# Altium schematic sheet Analog_Channel.SchDoc
size A4; SheetNumber: 2; SheetTotal: 6
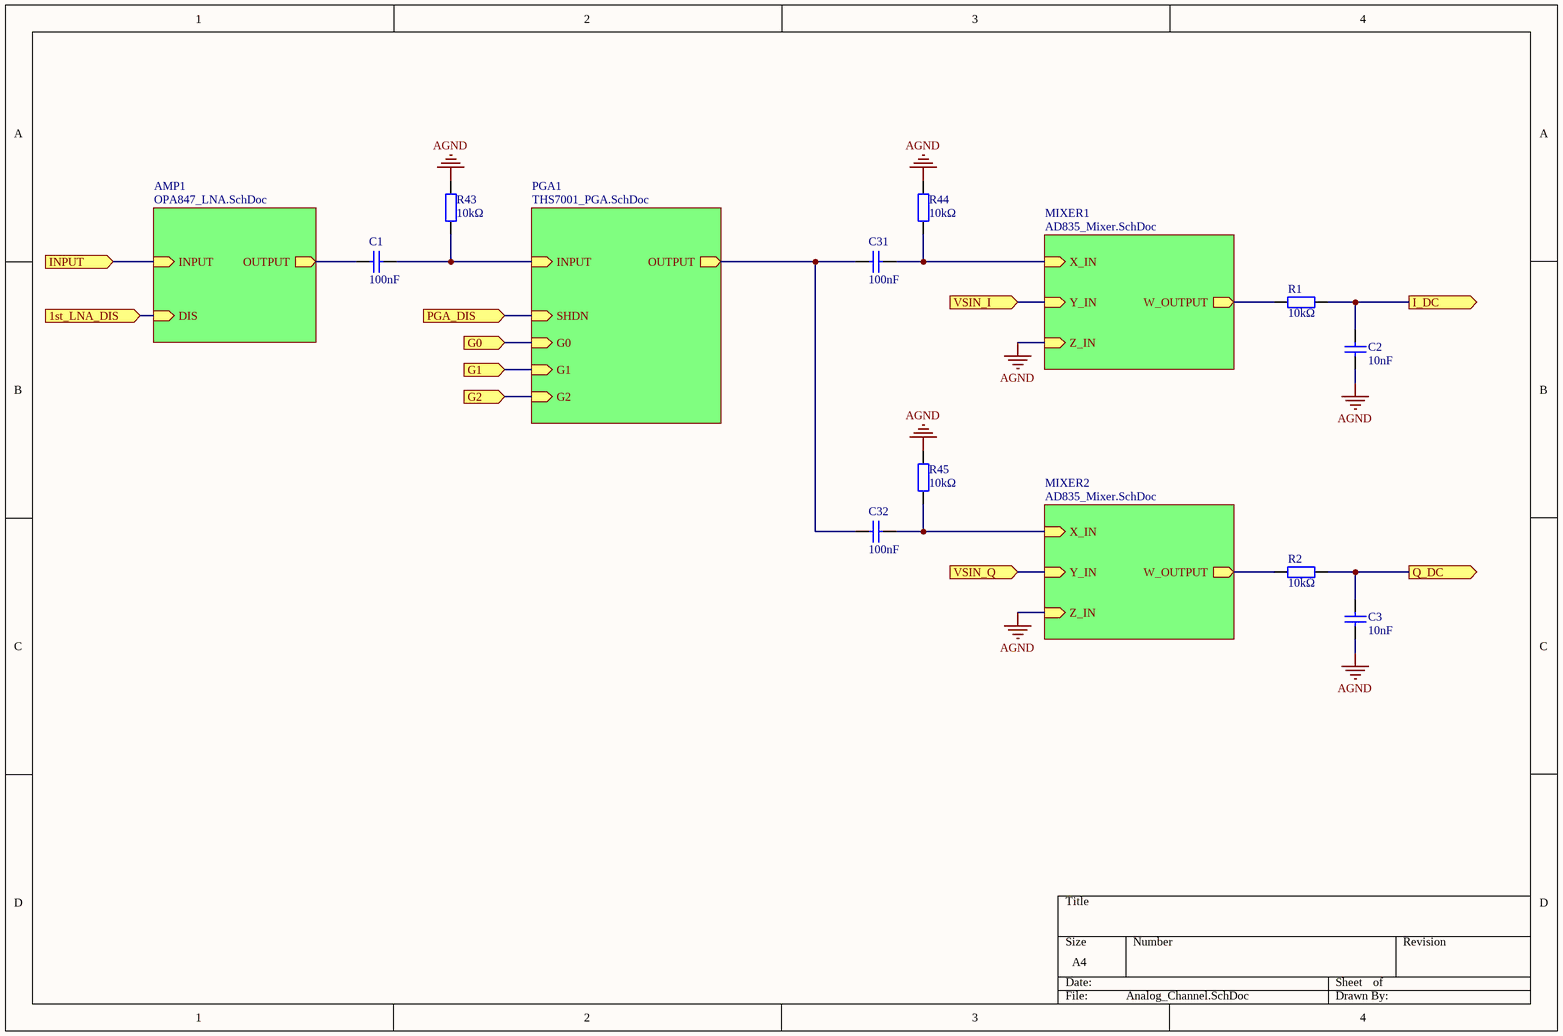
[diagram p0: Analog_Channel.SchDoc]

## Parts
C1  100nF  [0805_C]
C2  10nF  [0603_C]
C3  10nF  [0603_C]
C31  100nF  [0805_C]
C32  100nF  [0805_C]
R1  10kΩ  [0603_R]
R2  10kΩ  [0603_R]
R43  10kΩ  [0603_R]
R44  10kΩ  [0603_R]
R45  10kΩ  [0603_R]

## Sub-sheets
AMP1 = OPA847_LNA.SchDoc: INPUT (in), OUTPUT (out), DIS (in)
MIXER1 = AD835_Mixer.SchDoc: X_IN (in), Y_IN (in), Z_IN (in), W_OUTPUT (out)
MIXER2 = AD835_Mixer.SchDoc: X_IN (in), Y_IN (in), Z_IN (in), W_OUTPUT (out)
PGA1 = THS7001_PGA.SchDoc: G0 (in), G1 (in), G2 (in), SHDN (in), OUTPUT (out), INPUT (in)

## Ports
1st_LNA_DIS (in), G0 (in), G1 (in), G2 (in), I_DC (out), INPUT (in), PGA_DIS (in), Q_DC (out), VSIN_I (in), VSIN_Q (in)

## Nets
AGND: C2.1 C3.1 R43.1 R44.1 R45.1 ; sheet MIXER1/Z_IN, sheet MIXER2/Z_IN
1st_LNA_DIS: port 1st_LNA_DIS, sheet AMP1/DIS
G0: port G0, sheet PGA1/G0
G1: port G1, sheet PGA1/G1
G2: port G2, sheet PGA1/G2
I_DC: C2.2 R1.1 ; port I_DC
INPUT: port INPUT, sheet AMP1/INPUT
PGA_DIS: port PGA_DIS, sheet PGA1/SHDN
Q_DC: C3.2 R2.1 ; port Q_DC
VSIN_I: port VSIN_I, sheet MIXER1/Y_IN
VSIN_Q: port VSIN_Q, sheet MIXER2/Y_IN
NetC1_1: C1.1 ; sheet AMP1/OUTPUT
NetC1_2: C1.2 R43.2 ; sheet PGA1/INPUT
NetC31_1: C31.1 C32.1 ; sheet PGA1/OUTPUT
NetC31_2: C31.2 R44.2 ; sheet MIXER1/X_IN
NetC32_2: C32.2 R45.2 ; sheet MIXER2/X_IN
NetR1_2: R1.2 ; sheet MIXER1/W_OUTPUT
NetR2_2: R2.2 ; sheet MIXER2/W_OUTPUT

## Library data of the parts
C1 C31 C32 = 0805 100nF(104) 10% 50V: 贴片电容; ComponentLink1Description: 供应商链接; ComponentLink1URL: http://www.szlcsc.com/product/details_50686.html; Package: 0805; Supplier: LC; SuppliersPartNumber: C49678
C2 C3 = 0603 10nF (103) 10% 50V: 贴片电容; ComponentLink1Description: 供应商链接; ComponentLink1URL: http://www.szlcsc.com/product/details_58143.html; Package: 0603; Supplier: LC; SuppliersPartNumber: C57112
R1 R2 R43-R45 = 0603 10KΩ (1002) 1%: 贴片电阻; ComponentLink1Description: 供应商链接; ComponentLink1URL: http://www.szlcsc.com/product/details_26547.html; Package: 0603; Supplier: LC; SuppliersPartNumber: C25804